# Altium schematic sheet THS4302.SchDoc
size A4
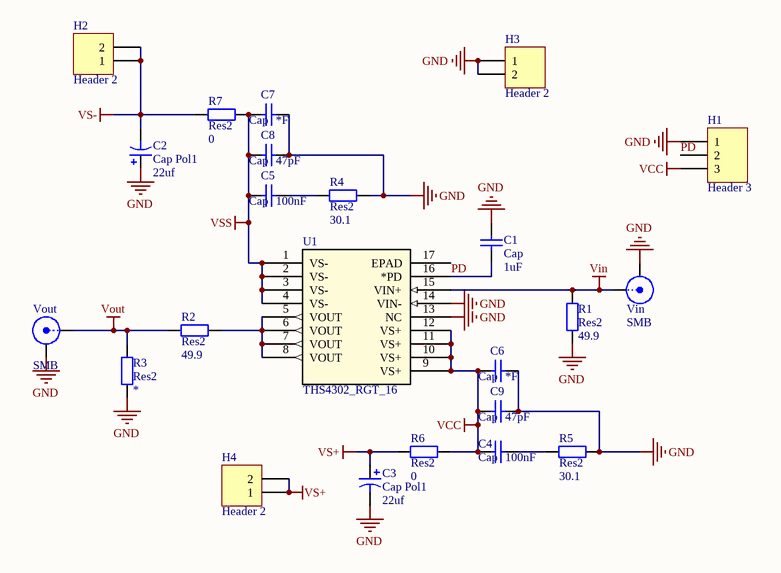
[diagram p0: THS4302.SchDoc]

## Parts
C1  Cap  value 1uF  [0805C]
C2  Cap Pol1  value 22uf  [CAP_SMD_3216]
C3  Cap Pol1  value 22uf  [CAP_SMD_3216]
C4  Cap  value 100nF  [0805C]
C5  Cap  value 100nF  [0805C]
C6  Cap  value *F  [CAP_SMD_3216]
C7  Cap  value *F  [CAP_SMD_3216]
C8  Cap  value 47pF  [0805C]
C9  Cap  value 47pF  [0805C]
H1  Header 3  [HDR1X3]
H2  Header 2  [HDR1X2]
H3  Header 2  [HDR1X2]
H4  Header 2  [HDR1X2]
R1  Res2  value 49.9  [0805R]
R2  Res2  value 49.9  [0805R]
R3  Res2  [0805R]
R4  Res2  value 30.1  [0805R]
R5  Res2  value 30.1  [0805R]
R6  Res2  value 0  [0805R]
R7  Res2  value 0  [0805R]
U1  THS4302_RGT_16  [RGT16_1P45X1P45]
Vin  SMB  [SMB_V-RJ45]
Vout  SMB  [SMB_V-RJ45]

## Nets
GND: C1.2 C2.1 C3.2 C6.2 C7.2 C8.2 C9.2 H1.1 H3.1 H3.2 R1.2 R3.1 R4.2 R5.2 U1.13(NC) U1.14(VIN-) Vin.2(Y) Vout.2(Y)
VCC: C4.1 C6.1 C9.1 H1.3 R6.2 U1.9(VS+) U1.10(VS+) U1.11(VS+) U1.12(VS+)
Vin: R1.1 U1.15(VIN+) Vin.1(X)
Vout: R2.1 R3.2 Vout.1(X)
VS+: C3.1 H4.1 H4.2 R6.1
VS-: C2.2 H2.1 H2.2 R7.1
VSS: C5.1 C7.1 C8.1 R7.2 U1.1(VS-) U1.2(VS-) U1.3(VS-) U1.4(VS-)
PD: C1.1 H1.2 U1.16(*PD)
NetC4_2: C4.2 R5.1
NetC5_2: C5.2 R4.1
NetR2_2: R2.2 U1.5(VOUT) U1.6(VOUT) U1.7(VOUT) U1.8(VOUT)

Not connected (* = marked no-connect by the designer): U1 17(EPAD)

## Library data of the parts
C1 C4-C9 = Cap: Capacitor; Published: 8-Jun-2000; LatestRevisionDate: 17-Jul-2002; LatestRevisionNote: Re-released for DXP Platform.; PackageReference: RAD-0.3; Publisher: Altium Limited; PackageDescription: Radial Cap, Thru-Hole; 2 Leads; 0.3 in Pin Spacing
C2 C3 = Cap Pol1: Polarized Capacitor (Radial); Published: 8-Jun-2000; LatestRevisionDate: 17-Jul-2002; LatestRevisionNote: Re-released for DXP Platform.; PackageReference: RB7.6-15; Publisher: Altium Limited; PackageDescription: Polarized Capacitor (Radial); 2 Leads
H1 = Header 3: Header, 3-Pin; LatestRevisionDate: 17-Jul-2002; LatestRevisionNote: Re-released for DXP Platform.; Publisher: Altium Limited
H2-H4 = Header 2: Header, 2-Pin; LatestRevisionDate: 17-Jul-2002; LatestRevisionNote: Re-released for DXP Platform.; Publisher: Altium Limited
R1-R7 = Res2: Resistor; Published: 8-Jun-2000; LatestRevisionDate: 17-Jul-2002; LatestRevisionNote: Re-released for DXP Platform.; PackageReference: AXIAL-0.4; Publisher: Altium Limited; PackageDescription: Axial Device, Thru-Hole; 2 Leads; 0.4 in Pin Spacing
  R3: Value: *
U1 = THS4302_RGT_16: Imported; Vendor: Texas Instruments; PACKAGE_DESIGNATOR: RGT; PIN_COUNT: 16; FAMILY_NAME: FIXED GAIN; INDUSTRY_STD_PKG_TYPE: QFN; Manufacturer_Part_Number: ths4302_rgt_16; GENERIC_PART_NUMBER: THS4302; Manufacturer: Texas Instruments; Datasheet_URL: http://www.ti.com/lit/gpn/THS4302; Value: Value; Type: Type; RefDes: RefDes
Vin Vout = SMB: SMB Straight Connector; LatestRevisionDate: 17-Jul-2002; LatestRevisionNote: Re-released for DXP Platform.; Publisher: Altium Limited